# Altium schematic sheet Vocm_Gen.SchDoc
size A4; Organization: Altium Limited; Address1: L3, 12a Rodborough Rd; Address2: Frenchs Forest; Address3: NSW; Address4: Australia 2086
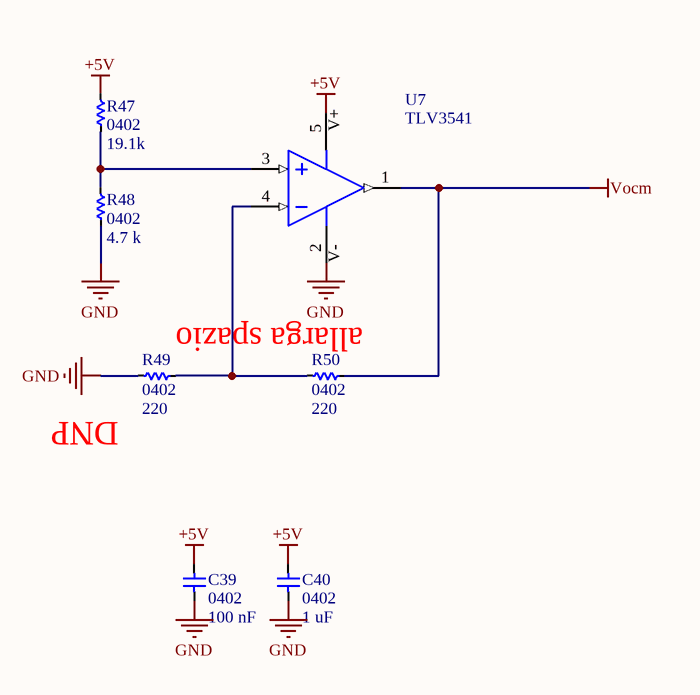
[diagram p0: Vocm_Gen.SchDoc]

## Parts
C39  0402  value 100 nF  [CAPCERSMD0402]
C40  0402  value 1 uF  [CAPCERSMD0402]
R47  0402  value 19.1k  [RESSMD0402]
R48  0402  value 4.7 k  [RESSMD0402]
R49  0402  value 220  [RESSMD0402]
R50  0402  value 220  [RESSMD0402]
U7  TLV3541  [SOT5_P95W280L290H145]

## Nets
+5V: C39.2 C40.2 R47.1 U7.5(V+)
GND: C39.1 C40.1 R48.2 R49.1 U7.2(V-)
Vocm: R50.2 U7.1(OUT)
NetR47_2: R47.2 R48.1 U7.3(IN+)
NetR49_2: R49.2 R50.1 U7.4(IN-)

## Notes on the sheet
- (near R50) allarga spazio
- (near R49) DNP
- Project Name:
- Revision:
- File Name:
- Date:
- Nuclear Instruments srl
- Via Lecco, 16, Lambrugo, Italy
- +39 031 2289570
- info@nuclearinstruments.eu
- http://www.nuclearinstruments.eu

## Library data of the parts
C39 = CAPCER0402_X7R_50V_100n: NICode: 00650000173; NIClass: Standard
C40 = CAPCER0402_X5R_10V_1u: NICode: 00650000182; NIClass: Standard
R47 = RES0402-19k1: NICode: 00300000367; NIClass: Standard
R48 = RES0402-4k7: NICode: 00300000057; NIClass: Standard
R49 R50 = RES0402-220R: NICode: 00300000040; NIClass: Standard
U7 = TLV3541IDBVT: TLV3541 200-MHz, Rail-to-Rail OPAMP; NICode: 00210000752; NIClass: Standard